# Altium schematic sheet Power.SchDoc
size A; SheetNumber: 3; SheetTotal: 6
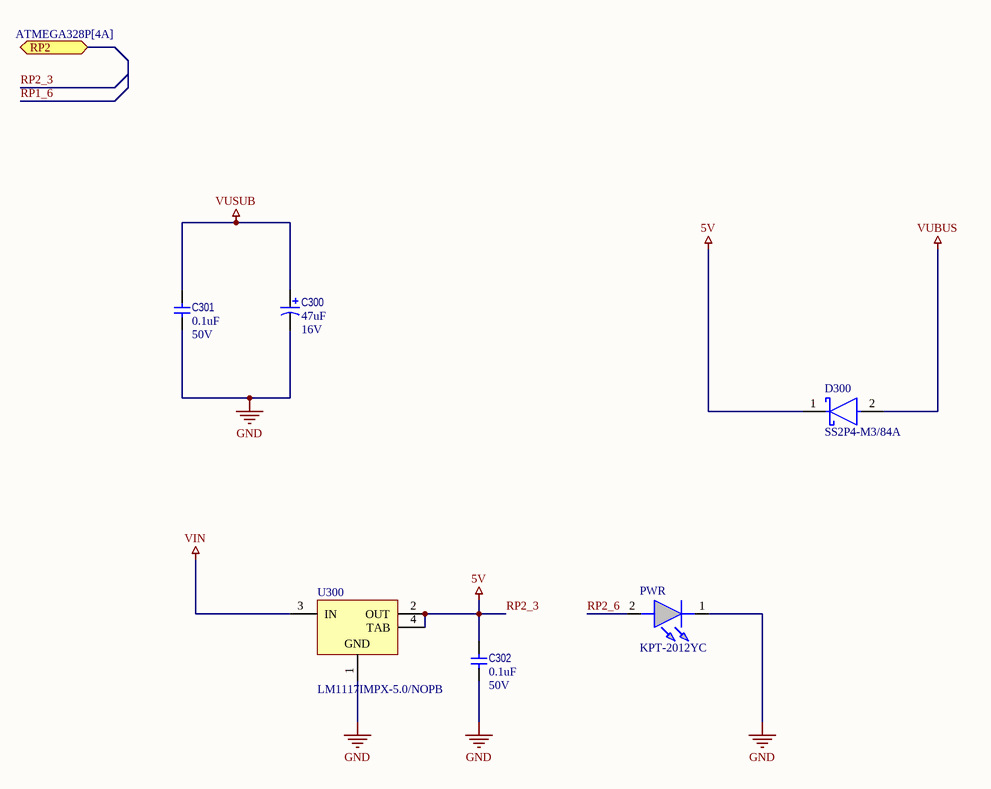
[diagram p0: Power.SchDoc]

## Parts
C300  Voltage_Rating: 16V  [CAPMP7343X430N]  (hidden comment: 47uF)
C301  Voltage_Rating: 50V  [CAPC1005X55N]  (hidden comment: 0.1uF)
C302  Voltage_Rating: 50V  [CAPC1005X55N]  (hidden comment: 0.1uF)
D300  SS2P4-M3/84A  [FP-96547-MFG]
PWR  KPT-2012YC  [LEDC2012X75N]
U300  LM1117IMPX-5.0/NOPB  [MP04A_M]

## Ports
RP2 (bidir, see ATMEGA328P[4A])

## Nets
GND: C300.2 C301.2 C302.2 PWR.1(K) U300.1(GND)
RP2_3: C302.1 D300.1(C) U300.2(OUT) U300.4(TAB)  [also labelled 5V]
VIN: U300.3(IN)
VUBUS: D300.2(A)
VUSUB: C300.1 C301.1
RP2_6: PWR.2(A)

## Library data of the parts
C300 = 30017: CAP TANT 47uF ±20% 16V 2917 (7343 Metric); Part_Type: Capacitor; Manufacturer Part Number: 16TQC47MW; Manufacturer: Panasonic; Part_Status: Obsolete; ID: 30017; Updated By: rclemmons; Sorted_Value: 4.7E-5; Value: 47uF; Sub_Type: TANT; Manufacturer Part Description: CAP TANT 47uF ±20% 16V 2917 (7343 Metric); Supplier 1: DigiKey; Supplier Part Number 1: P16487TR-ND; Package_Case: 2917 (7343 Metric); RoHS: Yes; Temperature Range: -55C to +105C; Tolerance: ±20%; Created By: rclemmons; Created_Date: 2014-12-11 21:29:30; Updated_Date: 2024-02-04 20:00:42; ComponentLink1Description: Datasheet; ComponentLink1URL: https://industrial.panasonic.com/cdbs/www-data/pdf/AAA8000/AAA8000C62.pdf; ComponentLink2Description: Supplier Part Details; ComponentLink2URL: https://www.digikey.com/products/en?keywords=16TQC47MW; Symbol Ref: CAP_POL; Size / Dimension: 0.287in L x 0.169in W (7.30mm x 4.30mm); Height - Seated (Max): 0.079in (2.00mm)
C301 C302 = 30041: CAP CER 0.1uF ±10% 50V X7R 0603 (1608 Metric); Part_Type: Capacitor; Manufacturer Part Number: C0603C104K5RECAUTO; Manufacturer: KEMET; Part_Status: New; ID: 30041; Updated By: randy; Sorted_Value: 1E-7; Value: 0.1uF; Sub_Type: CER; Manufacturer Part Description: CAP CER 0.1uF ±10% 50V X7R 0603 (1608 Metric); Supplier 1: DigiKey; Supplier Part Number 1: 399-14105-2-ND; Package_Case: 0603 (1608 Metric); RoHS: Yes; Temperature Range: -55C to +125C; Dielectric: X7R; Tolerance: ±10%; Created By: randy; Created_Date: 2024-03-31 22:55:42; Updated_Date: 2024-03-31 22:57:36; ComponentLink1Description: Datasheet; ComponentLink2Description: Supplier Part Details; ComponentLink2URL: https://www.digikey.com/products/en?keywords=C0603C104K5RECAUTO; Symbol Ref: CAP_NOPOL; Size / Dimension: 0.063in L x 0.031in W (1.60mm x 0.80mm)
D300 = CMP-02539-000061-1: DIODE SCHOTTKY 40V 2A DO220AA; Peak Non-Repetitive Surge Current: 50A; Max Reverse Current: 150uA; Element Configuration: Single; Forward Voltage: 550mV; Package Quantity: 3000; Case/Package: DO-220AA; Packaging: Tape and Reel; Average Rectified Current: 2A; Number of Pins: 2; Mount: Surface Mount; Length: 3.61mm; Contact Plating: Tin; Max Operating Temperature: 150°C; Min Operating Temperature: -55°C; Series: eSMP®; RoHS Compliant: No; Max Reverse Voltage (DC): 40V; Width: 2.18mm; Max Surge Current: 50A; Max Forward Surge Current (Ifsm): 50A; Lead Free: Lead Free; Max Repetitive Reverse Voltage (Vrrm): 40V; Forward Current: 2A; Radiation Hardening: No; Height: 1.15mm
PWR = KPT-2012YC: Kingbright KPT-2012YC Yellow LED, 588 nm, 2012 (0805), Rectangle Lens SMD Package; Geometry.Height: 0.75mm; Newark Part Number: *; Newark Price/Stock: *; Manufacturer_Name: Kingbright; Manufacturer_Part_Number: KPT-2012YC; Datasheet Link: https://componentsearchengine.com/Datasheets/2/KPT-2012YC.pdf
U300 = CMP-0062-01628-3: 800mA Low-Dropout Linear Regulator, 4-pin SOT-223, Pb-Free; Manufacturer: National Semiconductor; CompType: LDO IC; High-Reliability: Y; PackageTopMarking: XYTT*N06B; PowerWise: N; ComponentLink3Description: LM1117 Web Page; ComponentLink3URL: http://www.national.com/pf/LM/LM1117.html; DatasheetVersion: Apr-2006; ComponentLink2Description: LM1117 Datasheet; PackageVersion: revB, Apr-2003; ComponentLink4Description: MP04A Package Page; ComponentLink1Description: Manufacturer URL; PartNumber: LM1117IMPX-5.0/NOPB; ComponentLink1URL: http://www.national.com/; PackageReference: MP04A; ComponentLink2URL: http://www.national.com/ds/LM/LM1117.pdf; PinCount: 4; Code_JEDEC: TO-261-AA; RevisionNote: SCH symbol layout adjusted; ComponentLink4URL: http://www.national.com/packaging/folders/mp04a.html; RoHS: Y; Code_IPC: SOT223-4; PackageDescription: Molded SOT-223, 6.50 x 3.56 x 1.6mm Body, 4 Lead, 2.3mm Pitch